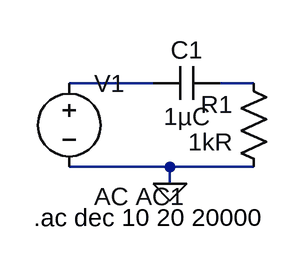
[diagram p0: schematic highpass.asc]
highpass.asc, the LTspice schematic file:
Version 4
SHEET 1 880 680
WIRE 112 112 32 112
WIRE 208 112 176 112
WIRE 128 192 32 192
WIRE 208 192 128 192
WIRE 128 208 128 192
FLAG 128 208 0
SYMBOL res 224 208 R180
WINDOW 0 36 76 Left 2
WINDOW 3 36 40 Left 2
SYMATTR InstName R1
SYMATTR Value 1kR
SYMBOL cap 176 96 R90
WINDOW 0 0 32 VBottom 2
WINDOW 3 32 32 VTop 2
SYMATTR InstName C1
SYMATTR Value 1µC
SYMBOL voltage 32 96 R0
WINDOW 123 24 124 Left 2
WINDOW 39 0 0 Left 0
SYMATTR InstName V1
SYMATTR Value ""
SYMATTR Value2 AC AC1
TEXT -2 240 Left 2 !.ac dec 10 20 20000

The netlist it stands for:
* highpass.asc
R1 0 N002 1kR
C1 N002 N001 1µC
V1 N001 0 AC AC1
.ac dec 10 20 20000
.backanno
.end